# Altium schematic sheet 1_wiring drawing.SchDoc: CAN HUB
size A2; ApprovedBy: Approved By; CheckedBy: Sky; DrawnBy: Jack; Address1: 1; Address2: 2; Address3: 3; Address4: 4; DocumentNumber: 04-TE-42-4015-0PA-A; Revision: B; SheetNumber: 2; SheetTotal: 6; SheetSize: A2; CheckedByDate: 2022-11-19; DrawByDate: 2022-11-17; SiteName: EMS TD Huangpu; PageSetup: Record=PageOptions|CenterHorizontal=True|CenterVertical=True|PrintScale=0.73|XCorrection=1.00|YCorrection=1.00|PrintKind=0|BorderSize=5000000|LeftOffset=0|BottomOffset=0|Orientation=2|PaperLength=1000|PaperWidth=1000|Scale=100|PaperSource=15|PrintQuality=1200|MediaType=1|DitherType=10|PaperKind=A3|PrintScaleMode=1; ProjectName: 19205_BMW CCU DDR PCBA FT fixture wiring
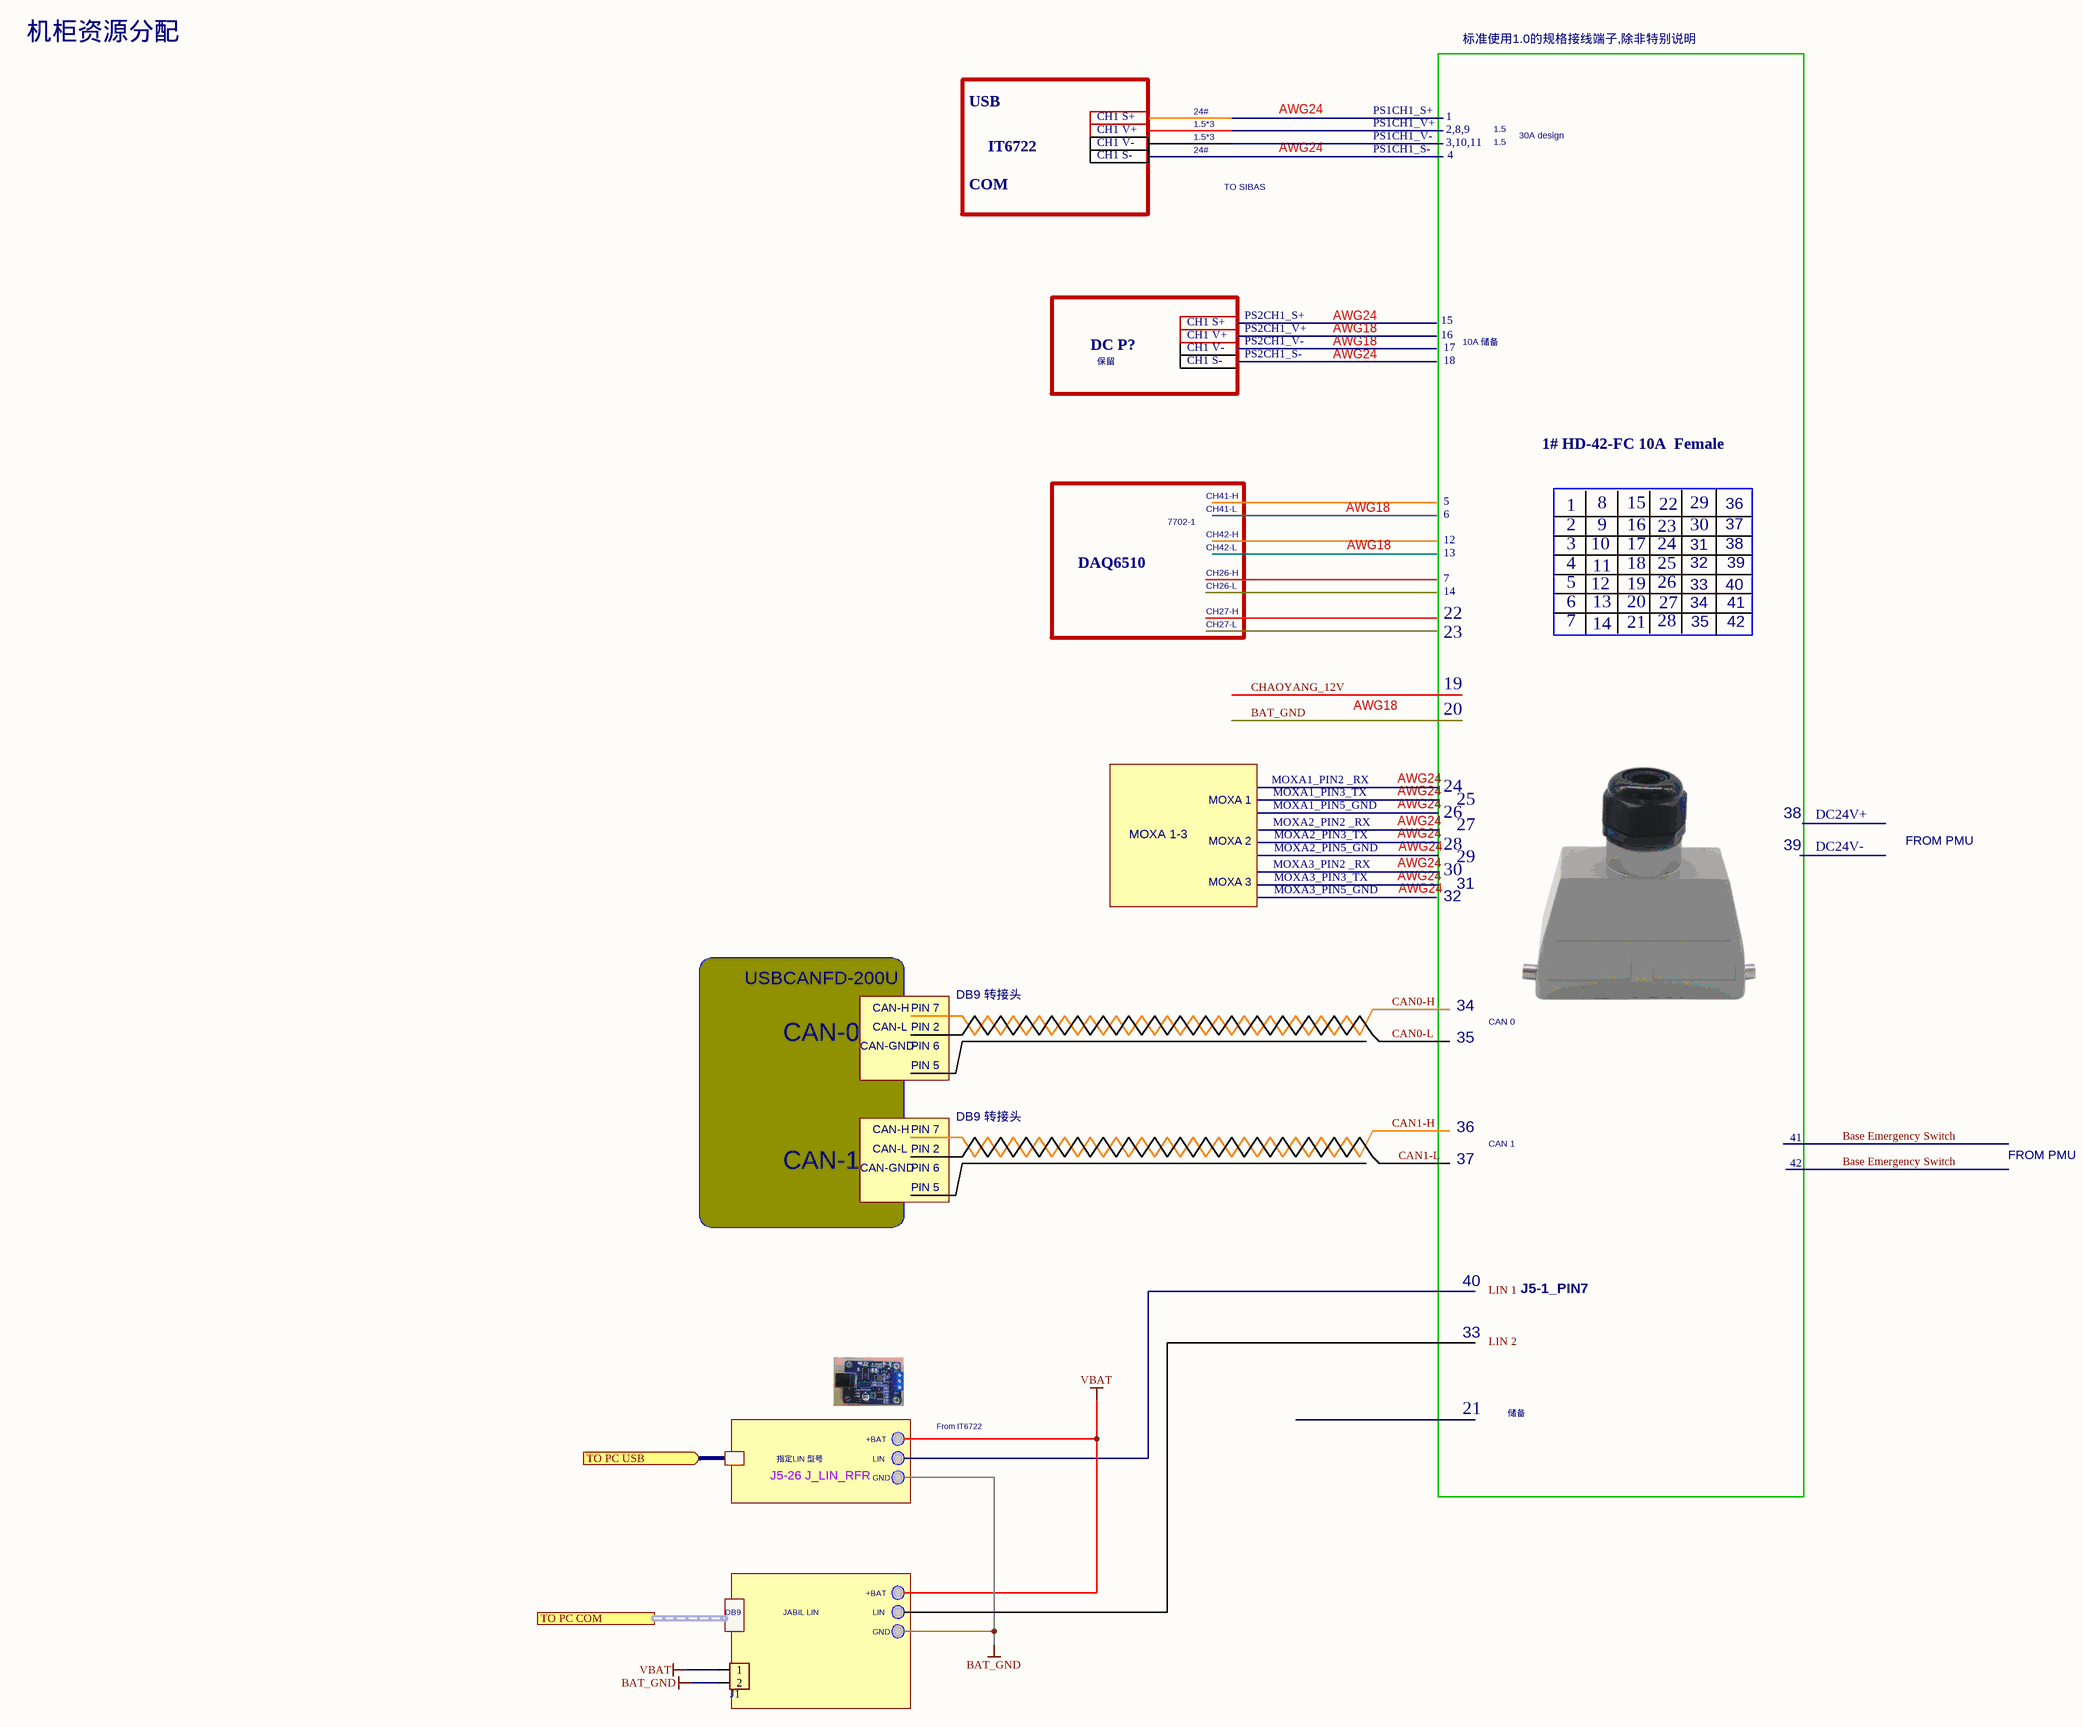
[diagram p0: 1_wiring drawing.SchDoc]

## Parts
J1  5.08mm conncetor  [5.08mm-2-Bend]  (value not drawn)

## Ports
TO PC COM, TO PC USB (in)

## Nets
BAT_GND: J1.2
VBAT: J1.1

## Notes on the sheet
- 机柜资源分配
- 标准使用1.0的规格接线端子,除非特别说明
- USB
- IT6722
- 1.5*3
- 24#
- AWG24
- 1
- 2,8,9
- 3,10,11
- 4
- 1.5
- 30A design
- COM
- TO SIBAS
- DC P?
- AWG18
- 15
- 16
- 17
- 10A 储备
- 保留
- 18
- 1# HD-42-FC 10A  Female
- 7702-1
- CH41-H
- CH41-L
- CH42-L
- CH42-H
- 6
- 12
- 5
- 2
- 8
- 9
- 23
- 22
- 29
- 30
- 36
- 37
- 38
- DAQ6510
- CH26-H
- CH26-L
- 13
- 14
- 7
- 3
- 10
- 11
- 19
- 20
- 24
- 25
- 26
- 27
- 31
- 32
- 33
- 34
- 40
- 39
- 41
- CH27-H
- CH27-L
- 21
- 28
- 35
- 42
- MOXA 1
- MOXA 1-3
- MOXA 2
- DC24V+
- DC24V-
- FROM PMU
- MOXA 3
- USBCANFD-200U
- CAN-0
- CAN-GND
- CAN-H
- CAN-L
- PIN 2
- PIN 7
- PIN 6
- DB9 转接头
- CAN 0
- PIN 5
- CAN-1
- CAN 1
- J5-1_PIN7
- +BAT
- From IT6722
- 储备
- 指定LIN 型号
- LIN
- GND
- DB9
- JABIL LIN
- Labels drawn without touching a wire or pin: CAN0-H, CAN0-L, CAN1-H, CAN1-L, CH1 S+, CH1 S-, CH1 V+, CH1 V-, J5-26 J_LIN_RFR, LIN 1, LIN 2
- Document Number:
- Rev:
- Project Name:
- Drawn By:
- Date:
- Titile:
- Checked By:
- Sheet:
- Of

## Library data of the parts
J1 = CON2-5.08